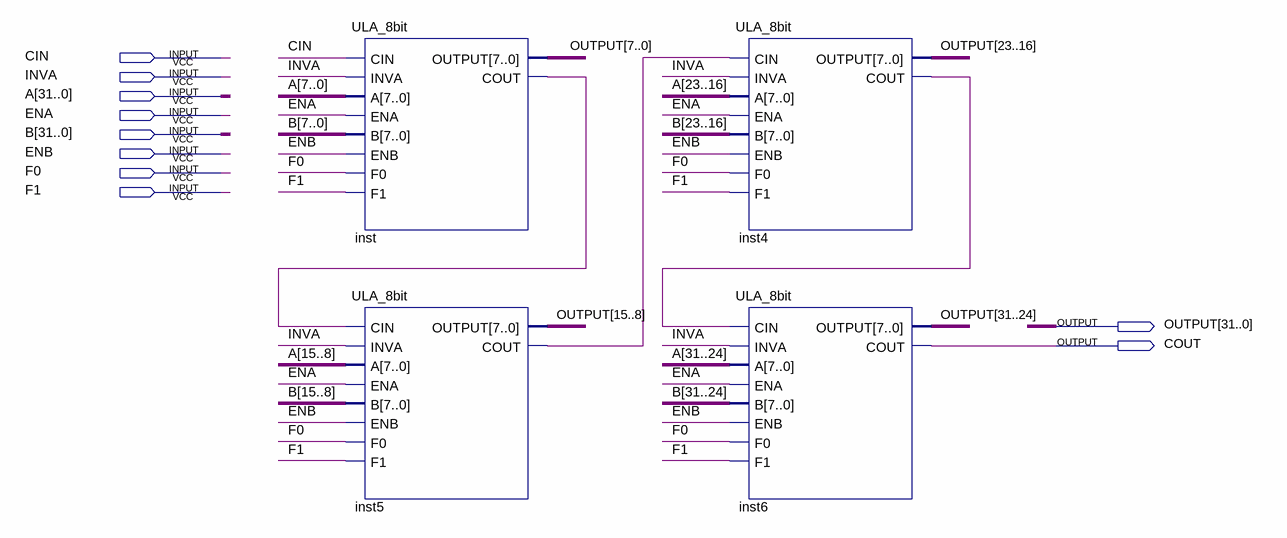
[diagram p0: schematic sheet]
// Quartus schematic ULA_32bit.bdf as structural Verilog: 4 symbols, 10 pins
module ULA_32bit (
  input  CIN,
  input  INVA,
  input  [31:0] A,
  input  ENA,
  input  [31:0] B,
  input  ENB,
  input  F0,
  input  F1,
  output [31:0] OUTPUT,
  output COUT
);

  wire inst4_cout, inst5_cout, inst_cout;

  ULA_8bit inst (
    .CIN(CIN), .INVA(INVA), .A(A[7:0]), .ENA(ENA), .B(B[7:0]), .ENB(ENB), .F0(F0), .F1(F1),
    .OUTPUT(OUTPUT[7:0]), .COUT(inst_cout));
  ULA_8bit inst5 (
    .CIN(inst_cout), .INVA(INVA), .A(A[15:8]), .ENA(ENA), .B(B[15:8]), .ENB(ENB), .F0(F0), .F1(F1),
    .OUTPUT(OUTPUT[15:8]), .COUT(inst5_cout));
  ULA_8bit inst4 (
    .CIN(inst5_cout), .INVA(INVA), .A(A[23:16]), .ENA(ENA), .B(B[23:16]), .ENB(ENB), .F0(F0), .F1(F1),
    .OUTPUT(OUTPUT[23:16]), .COUT(inst4_cout));
  ULA_8bit inst6 (
    .CIN(inst4_cout), .INVA(INVA), .A(A[31:24]), .ENA(ENA), .B(B[31:24]), .ENB(ENB), .F0(F0), .F1(F1),
    .OUTPUT(OUTPUT[31:24]), .COUT(COUT));
endmodule
